# Altium project PCB_Project2.PrjPCB
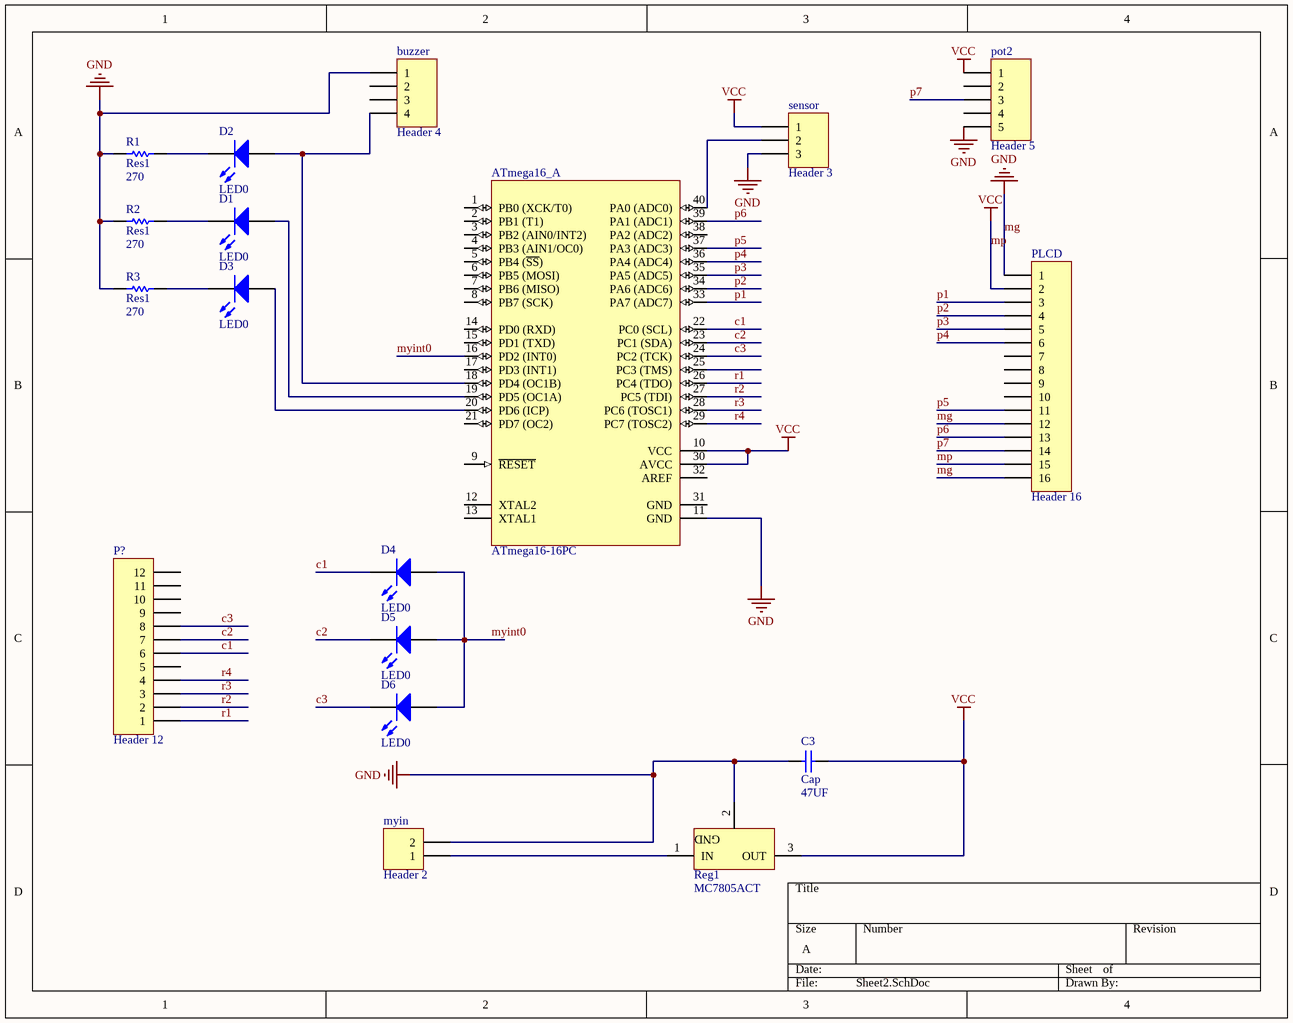
[diagram p0: Sheet2.SchDoc]
1 sheet, 18 parts. Net scope: global (net labels, ports and power ports of the same name join across sheets).
Board file: PCB2.PcbDoc

## Sheet Sheet2.SchDoc
size A

### Parts
ATmega16_A  ATmega16-16PC  [40P6]
buzzer  Header 4  [HDR1X4]
C3  Cap  value 47UF  [RAD-0.3]
D1  LED0  [RB5-10.5]
D2  LED0  [RB5-10.5]
D3  LED0  [RB5-10.5]
D4  LED0  [RB5-10.5]
D5  LED0  [RB5-10.5]
D6  LED0  [RB5-10.5]
myin  Header 2  [HDR1X2]
P?  Header 12  [HDR1X12]
PLCD  Header 16  [HDR1X16]
pot2  Header 5  [HDR1X5]
R1  Res1  value 270  [AXIAL-0.3]
R2  Res1  value 270  [AXIAL-0.3]
R3  Res1  value 270  [AXIAL-0.3]
Reg1  MC7805ACT  [HDR1X3]
sensor  Header 3  [HDR1X3]

### Nets
mg: ATmega16_A.11(GND) buzzer.1 C3.1 myin.2 PLCD.1 PLCD.12 PLCD.16 pot2.5 R1.1 R2.1 R3.1 Reg1.2(GND) sensor.3  [also labelled GND]
mp: ATmega16_A.10(VCC) ATmega16_A.30(AVCC) C3.2 PLCD.2 PLCD.15 pot2.1 Reg1.3(OUT) sensor.1  [also labelled VCC]
c1: ATmega16_A.22(PC0_(SCL)) D4.2(K) P?.6
c2: ATmega16_A.23(PC1_(SDA)) D5.2(K) P?.7
c3: ATmega16_A.24(PC2_(TCK)) D6.2(K) P?.8
myint0: ATmega16_A.16(PD2_(INT0)) D4.1(A) D5.1(A) D6.1(A)
p1: ATmega16_A.33(PA7_(ADC7)) PLCD.3
p2: ATmega16_A.34(PA6_(ADC6)) PLCD.4
p3: ATmega16_A.35(PA5_(ADC5)) PLCD.5
p4: ATmega16_A.36(PA4_(ADC4)) PLCD.6
p5: ATmega16_A.37(PA3_(ADC3)) PLCD.11
p6: ATmega16_A.39(PA1_(ADC1)) PLCD.13
p7: PLCD.14 pot2.3
r1: ATmega16_A.26(PC4_(TDO)) P?.1
r2: ATmega16_A.27(PC5_(TDI)) P?.2
r3: ATmega16_A.28(PC6_(TOSC1)) P?.3
r4: ATmega16_A.29(PC7_(TOSC2)) P?.4
NetATmega16_A_18: ATmega16_A.18(PD4_(OC1B)) buzzer.4 D2.1(A)
NetATmega16_A_19: ATmega16_A.19(PD5_(OC1A)) D1.1(A)
NetATmega16_A_20: ATmega16_A.20(PD6_(ICP)) D3.1(A)
NetATmega16_A_40: ATmega16_A.40(PA0_(ADC0)) sensor.2
NetD1_2: D1.2(K) R2.2
NetD2_2: D2.2(K) R1.2
NetD3_2: D3.2(K) R3.2
Netmyin_1: myin.1 Reg1.1(IN)

Not connected (* = marked no-connect by the designer): ATmega16_A 1(PB0_(XCK/T0)) 2(PB1_(T1)) 3(PB2_(AIN0/INT2)) 4(PB3_(AIN1/OC0)) 5(PB4_(~{SS})) 6(PB5_(MOSI)) 7(PB6_(MISO)) 8(PB7_(SCK)) 9(~{RESET}) 12(XTAL2) 13(XTAL1) 14(PD0_(RXD)) 15(PD1_(TXD)) 17(PD3_(INT1)) 21(PD7_(OC2)) 25(PC3_(TMS)) 31(GND) 32(AREF) 38(PA2_(ADC2)); buzzer 2 3; P? 5 9 10 11 12; PLCD 7 8 9 10; pot2 2 4

### Library data of the parts
ATmega16_A = ATmega16-16PC: 8-Bit AVR Microcontroller with 16K Bytes of In-System Programmable Flash Memory; Published: 17-Sep-2003; LatestRevisionDate: 04-Mar-2005; LatestRevisionNote: Stylized 3D Model Added.; DatasheetVersion: 2466E-AVR-10/02; PackageVersion: Dec-1999; PackageReference: 40P6; Publisher: Altium Limited; PackageDescription: DIP; 40 Leads; Row Spacing 15.24 mm; Pitch 2.54 mm; ComponentLink1Description: Manufacturer Link; ComponentLink1URL: http://www.atmel.com; ComponentLink2Description: Datasheet; ComponentLink2URL: http://www.atmel.com/dyn/resources/prod_documents/doc2466.pdf
buzzer = Header 4: Header, 4-Pin; LatestRevisionDate: 17-Jul-2002; LatestRevisionNote: Re-released for DXP Platform.; Publisher: Altium Limited
C3 = Cap: Capacitor; Published: 8-Jun-2000; LatestRevisionDate: 17-Jul-2002; LatestRevisionNote: Re-released for DXP Platform.; PackageReference: RAD-0.3; Publisher: Altium Limited
D1-D6 = LED0: Typical INFRARED GaAs LED; Published: 8-Jun-2000; LatestRevisionDate: 08-Jul-2005; LatestRevisionNote: Mech Layer 1 removed.; PackageReference: LED-0; Publisher: Altium Limited
myin = Header 2: Header, 2-Pin; LatestRevisionDate: 17-Jul-2002; LatestRevisionNote: Re-released for DXP Platform.; Publisher: Altium Limited
P? = Header 12: Header, 12-Pin; LatestRevisionDate: 17-Jul-2002; LatestRevisionNote: Re-released for DXP Platform.; Publisher: Altium Limited
PLCD = Header 16: Header, 16-Pin; LatestRevisionDate: 17-Jul-2002; LatestRevisionNote: Re-released for DXP Platform.; Publisher: Altium Limited
pot2 = Header 5: Header, 5-Pin; LatestRevisionDate: 17-Jul-2002; LatestRevisionNote: Re-released for DXP Platform.; Publisher: Altium Limited
R1-R3 = Res1: Resistor; Published: 8-Jun-2000; LatestRevisionDate: 17-Jul-2002; LatestRevisionNote: Re-released for DXP Platform.; PackageReference: AXIAL-0.3; Publisher: Altium Limited
Reg1 = MC7805ACT: 3-Terminal Positive Fixed Voltage Regulator; Note: Pin 2 is electrically connected to TAB; Published: 17-Jul-2002; DatasheetVersion: 1988; PackageReference: 221A-04; Publisher: Altium Limited; PackageDescription: TO, Thru-Hole, Vertical, Heatsink Mounted; 3 In-Line Leads; Pitch 2.54 mm; Code_JEDEC: TO-262-AA; ComponentLink1Description: Manufacturer Link; ComponentLink1URL: http://www.onsemi.com/site/products/taxonomy/0,4438,503,00.html; ComponentLink2Description: Datasheet; ComponentLink2URL: http://www.onsemi.com/pub/Collateral/MC7800-D.PDF
sensor = Header 3: Header, 3-Pin; LatestRevisionDate: 17-Jul-2002; LatestRevisionNote: Re-released for DXP Platform.; Publisher: Altium Limited